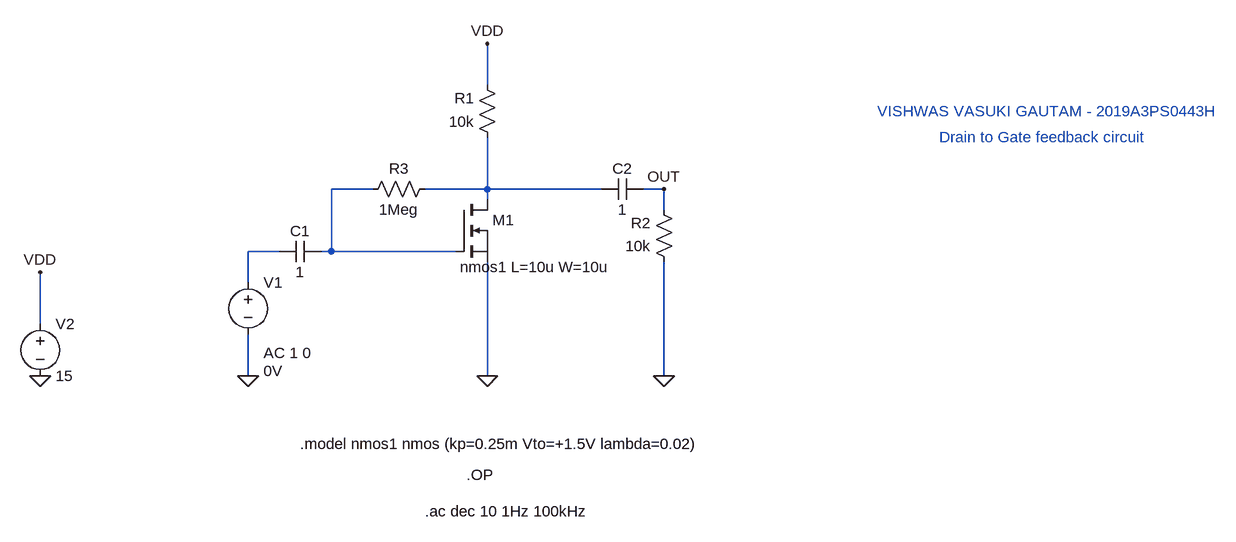
[diagram p0: schematic Drain_to_gate_feedback_lab8.asc]
Drain_to_gate_feedback_lab8.asc, the LTspice schematic file:
Version 4
SHEET 1 956 680
WIRE -240 -432 -240 -496
WIRE -416 -272 -480 -272
WIRE -240 -272 -240 -352
WIRE -240 -272 -336 -272
WIRE -64 -272 -240 -272
WIRE 32 -272 0 -272
WIRE -240 -256 -240 -272
WIRE 32 -240 32 -272
WIRE -560 -176 -608 -176
WIRE -480 -176 -480 -272
WIRE -480 -176 -496 -176
WIRE -288 -176 -480 -176
WIRE -608 -128 -608 -176
WIRE -928 -64 -928 -144
WIRE -608 16 -608 -48
WIRE -240 16 -240 -160
WIRE 32 16 32 -160
FLAG -928 16 0
FLAG -240 -496 VDD
FLAG -928 -144 VDD
FLAG -608 16 0
FLAG -240 16 0
FLAG 32 16 0
FLAG 32 -272 OUT
SYMBOL res -224 -336 R180
WINDOW 0 36 76 Left 2
WINDOW 3 36 40 Left 2
SYMATTR InstName R1
SYMATTR Value 10k
SYMBOL res 48 -144 R180
WINDOW 0 36 76 Left 2
WINDOW 3 36 40 Left 2
SYMATTR InstName R2
SYMATTR Value 10k
SYMBOL res -320 -288 R90
WINDOW 0 0 56 VBottom 2
WINDOW 3 32 56 VTop 2
SYMATTR InstName R3
SYMATTR Value 1Meg
SYMBOL cap -560 -160 R270
WINDOW 0 32 32 VTop 2
WINDOW 3 0 32 VBottom 2
SYMATTR InstName C1
SYMATTR Value 1
SYMBOL voltage -608 -144 R0
WINDOW 3 24 152 Left 2
WINDOW 123 24 124 Left 2
WINDOW 39 0 0 Left 2
SYMATTR Value 0V
SYMATTR Value2 AC 1 0
SYMATTR InstName V1
SYMBOL cap -64 -256 R270
WINDOW 0 32 32 VTop 2
WINDOW 3 0 32 VBottom 2
SYMATTR InstName C2
SYMATTR Value 1
SYMBOL voltage -928 -80 R0
WINDOW 123 0 0 Left 2
WINDOW 39 0 0 Left 2
SYMATTR InstName V2
SYMATTR Value 15
SYMBOL nmos -288 -256 R0
WINDOW 3 6 104 Left 2
SYMATTR Value nmos1 L=10u W=10u
SYMATTR InstName M1
TEXT -528 120 Left 2 !.model nmos1 nmos (kp=0.25m Vto=+1.5V lambda=0.02)
TEXT -272 168 Left 2 !.OP
TEXT -336 224 Left 2 !.ac dec 10 1Hz 100kHz
TEXT 360 -392 Left 2 ;VISHWAS VASUKI GAUTAM - 2019A3PS0443H
TEXT 456 -352 Left 2 ;Drain to Gate feedback circuit

The netlist it stands for:
* Drain_to_gate_feedback_lab8.asc
R1 N002 VDD 10k
R2 0 OUT 10k
R3 N002 N001 1Meg
C1 N003 N001 1
V1 N003 0 0V AC 1 0
C2 N002 OUT 1
V2 VDD 0 15
M1 N002 N001 0 0 nmos1 L=10u W=10u
.model NMOS NMOS
.model PMOS PMOS
.lib standard.mos
.model nmos1 nmos (kp=0.25m Vto=+1.5V lambda=0.02)
.OP
.ac dec 10 1Hz 100kHz
* VISHWAS VASUKI GAUTAM - 2019A3PS0443H
* Drain to Gate feedback circuit
.backanno
.end